# EasyEDA Pro project PX4_FMUv6X_Dev_Board.eprj, schematic FMUv6X Dev Board, sheets 7 to 11 of 11

## Sheets
7 Ethernet 100 Base-TX: Create Date: 2025-08-15; Page Name: Ethernet 100 Base-TX; Update Date: 2025-08-15
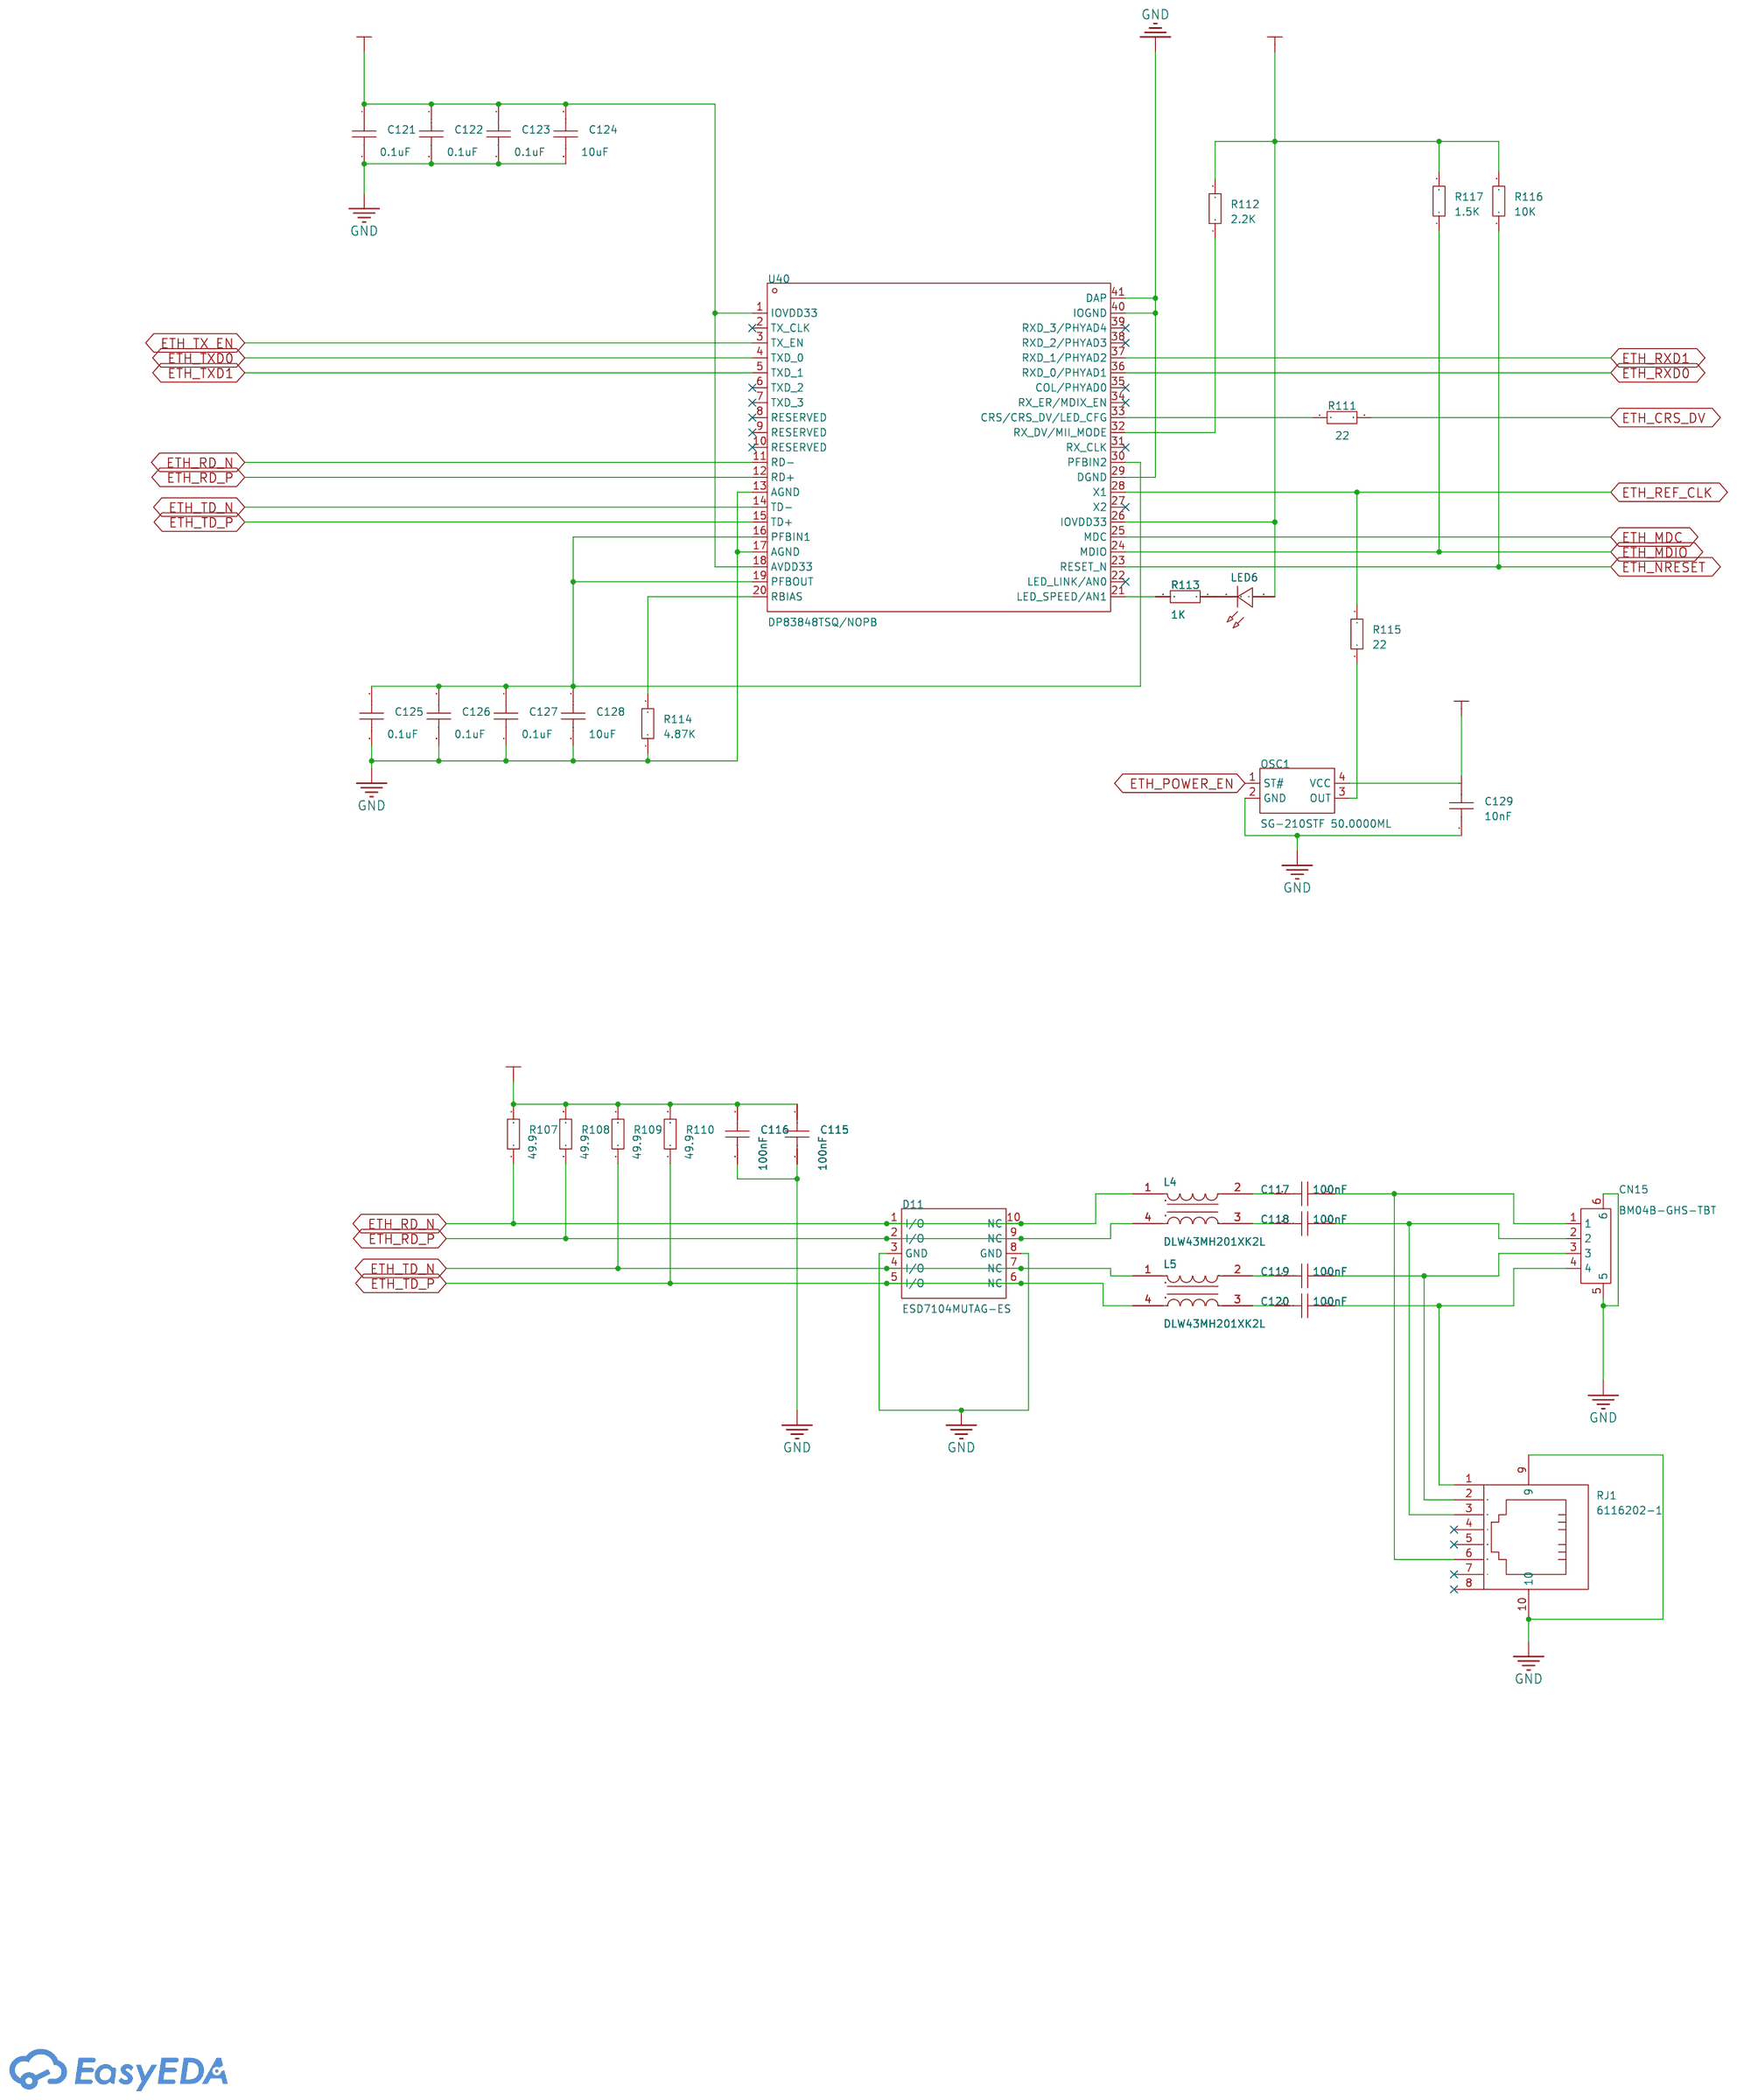
[diagram p6: Ethernet 100 Base-TX]
8 UART and GPS Connectors: Create Date: 2025-08-15; Page Name: UART and GPS Connectors; Update Date: 2025-08-17
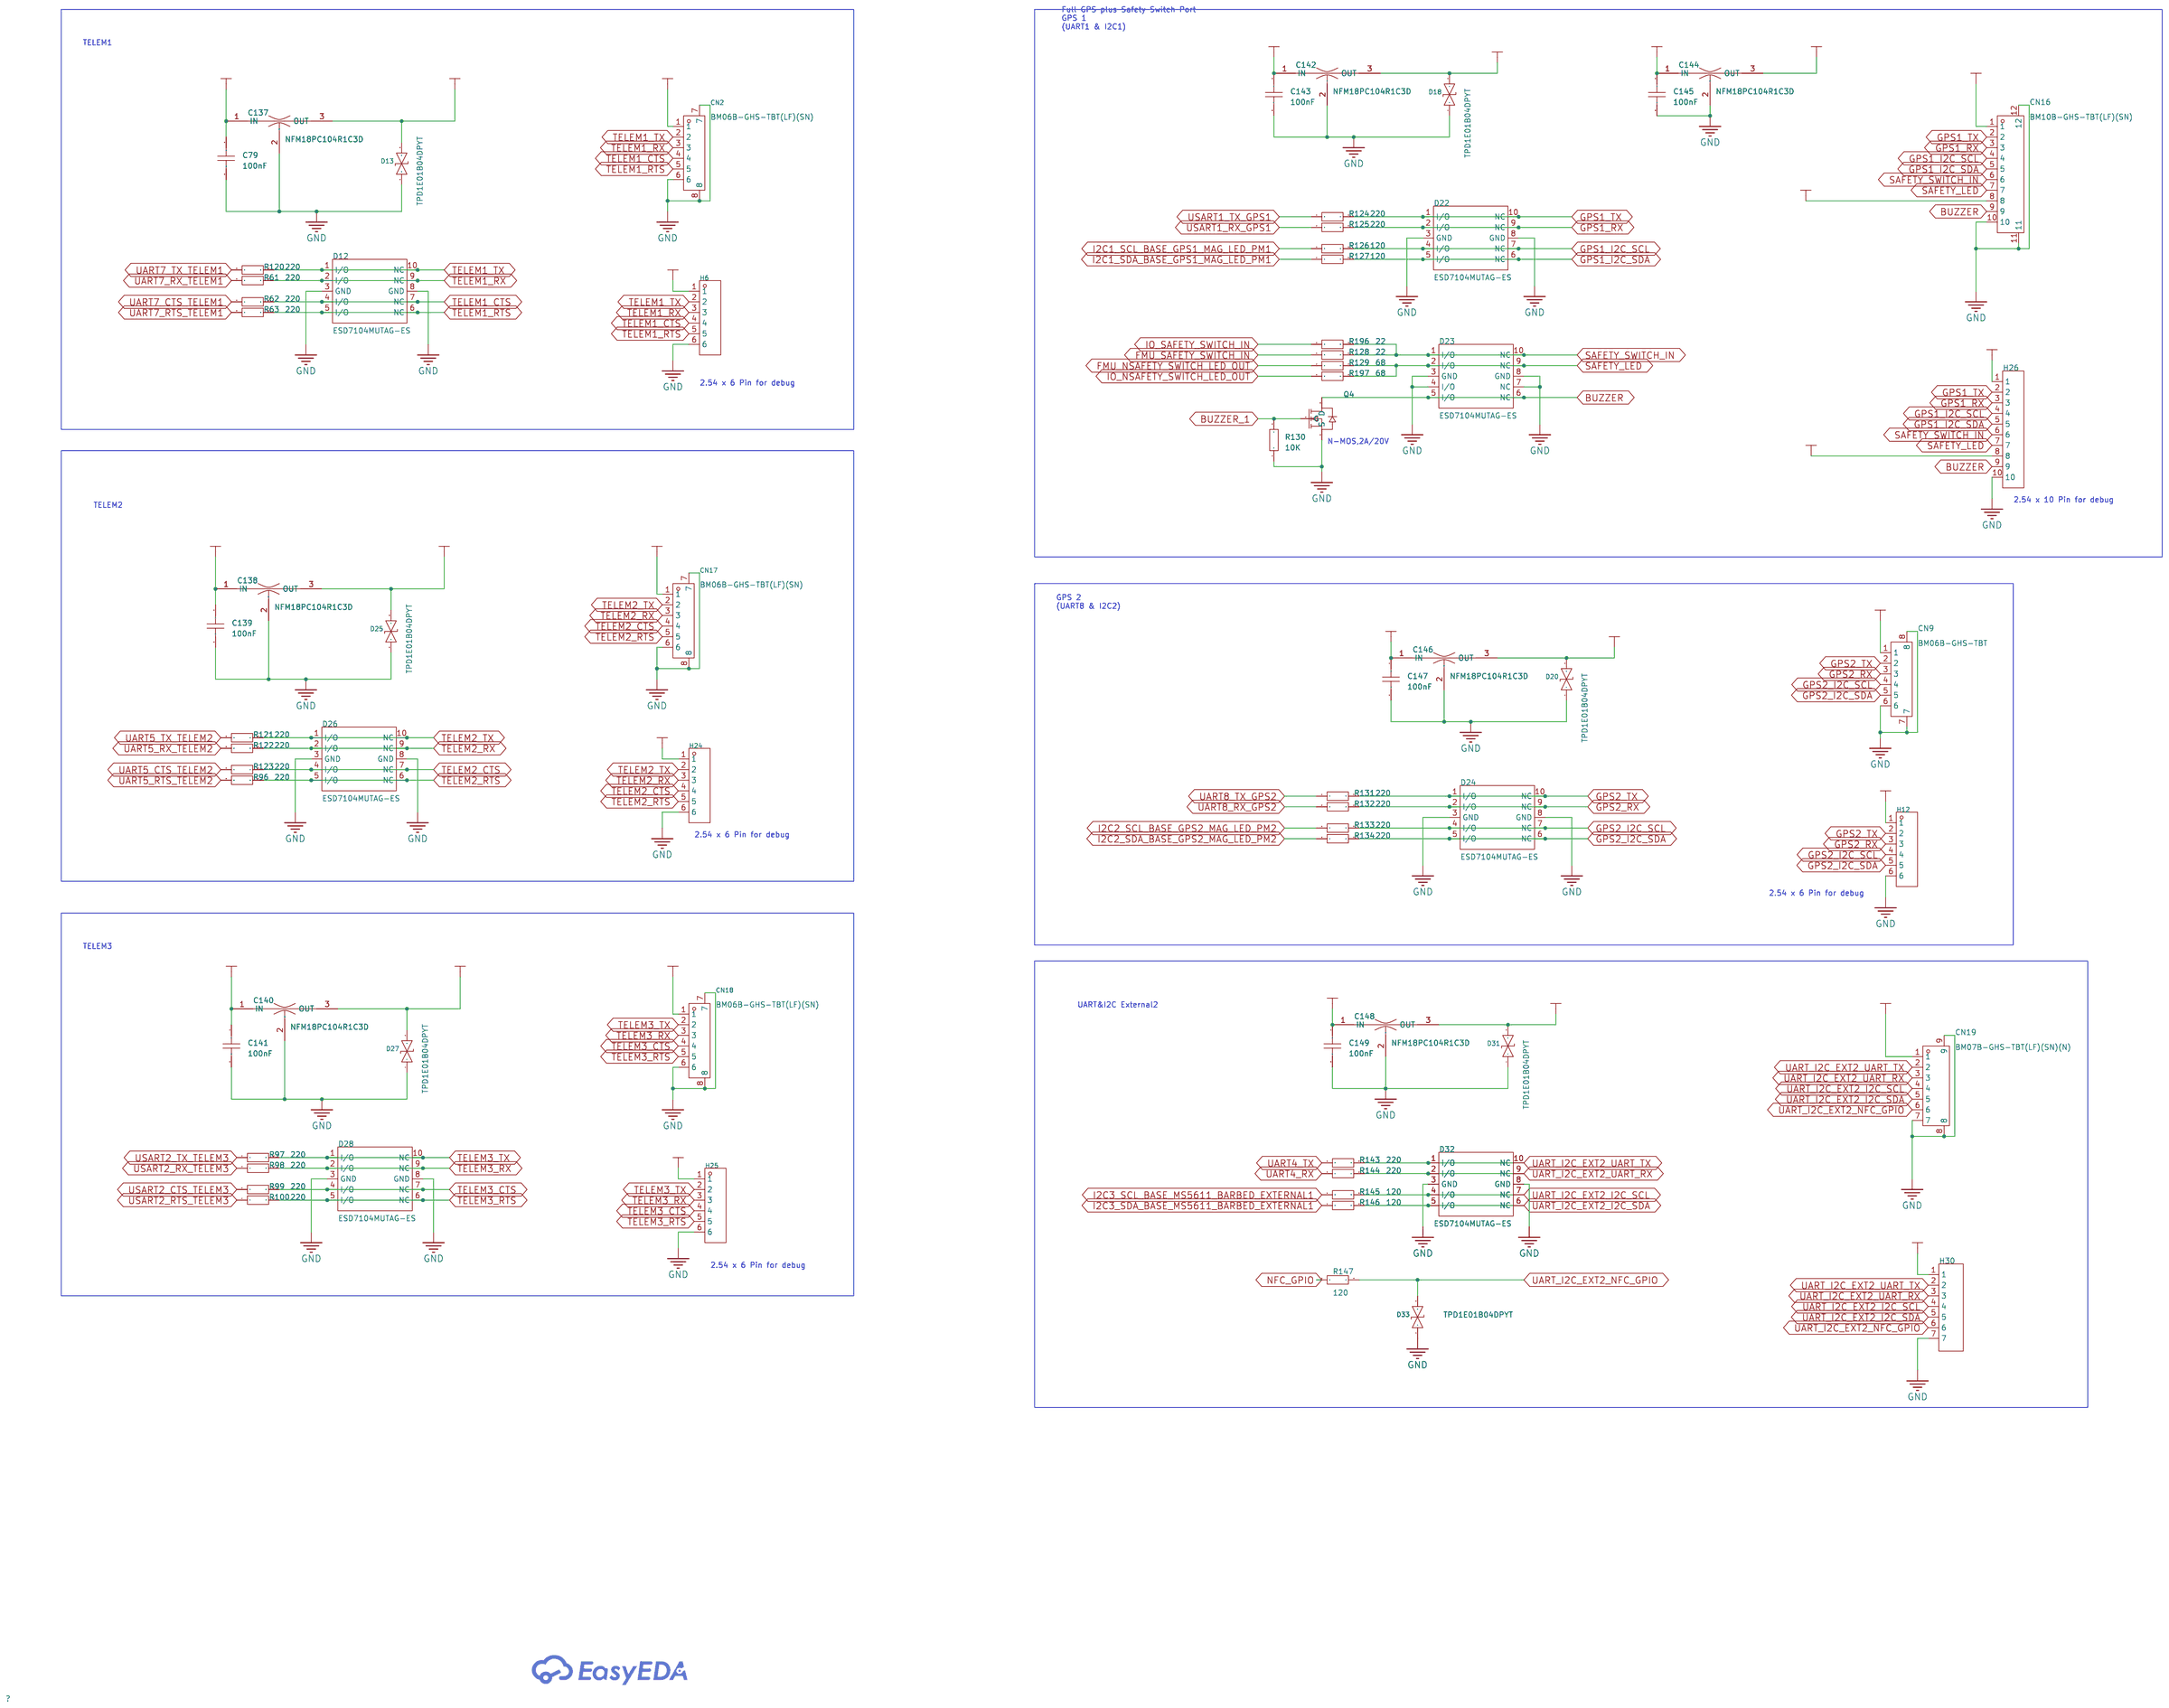
[diagram p7: UART and GPS Connectors]
9 GPIO 2.54mm 16x8: Create Date: 2025-08-15; Page Name: GPIO 2.54mm 16x8; Update Date: 2025-08-17
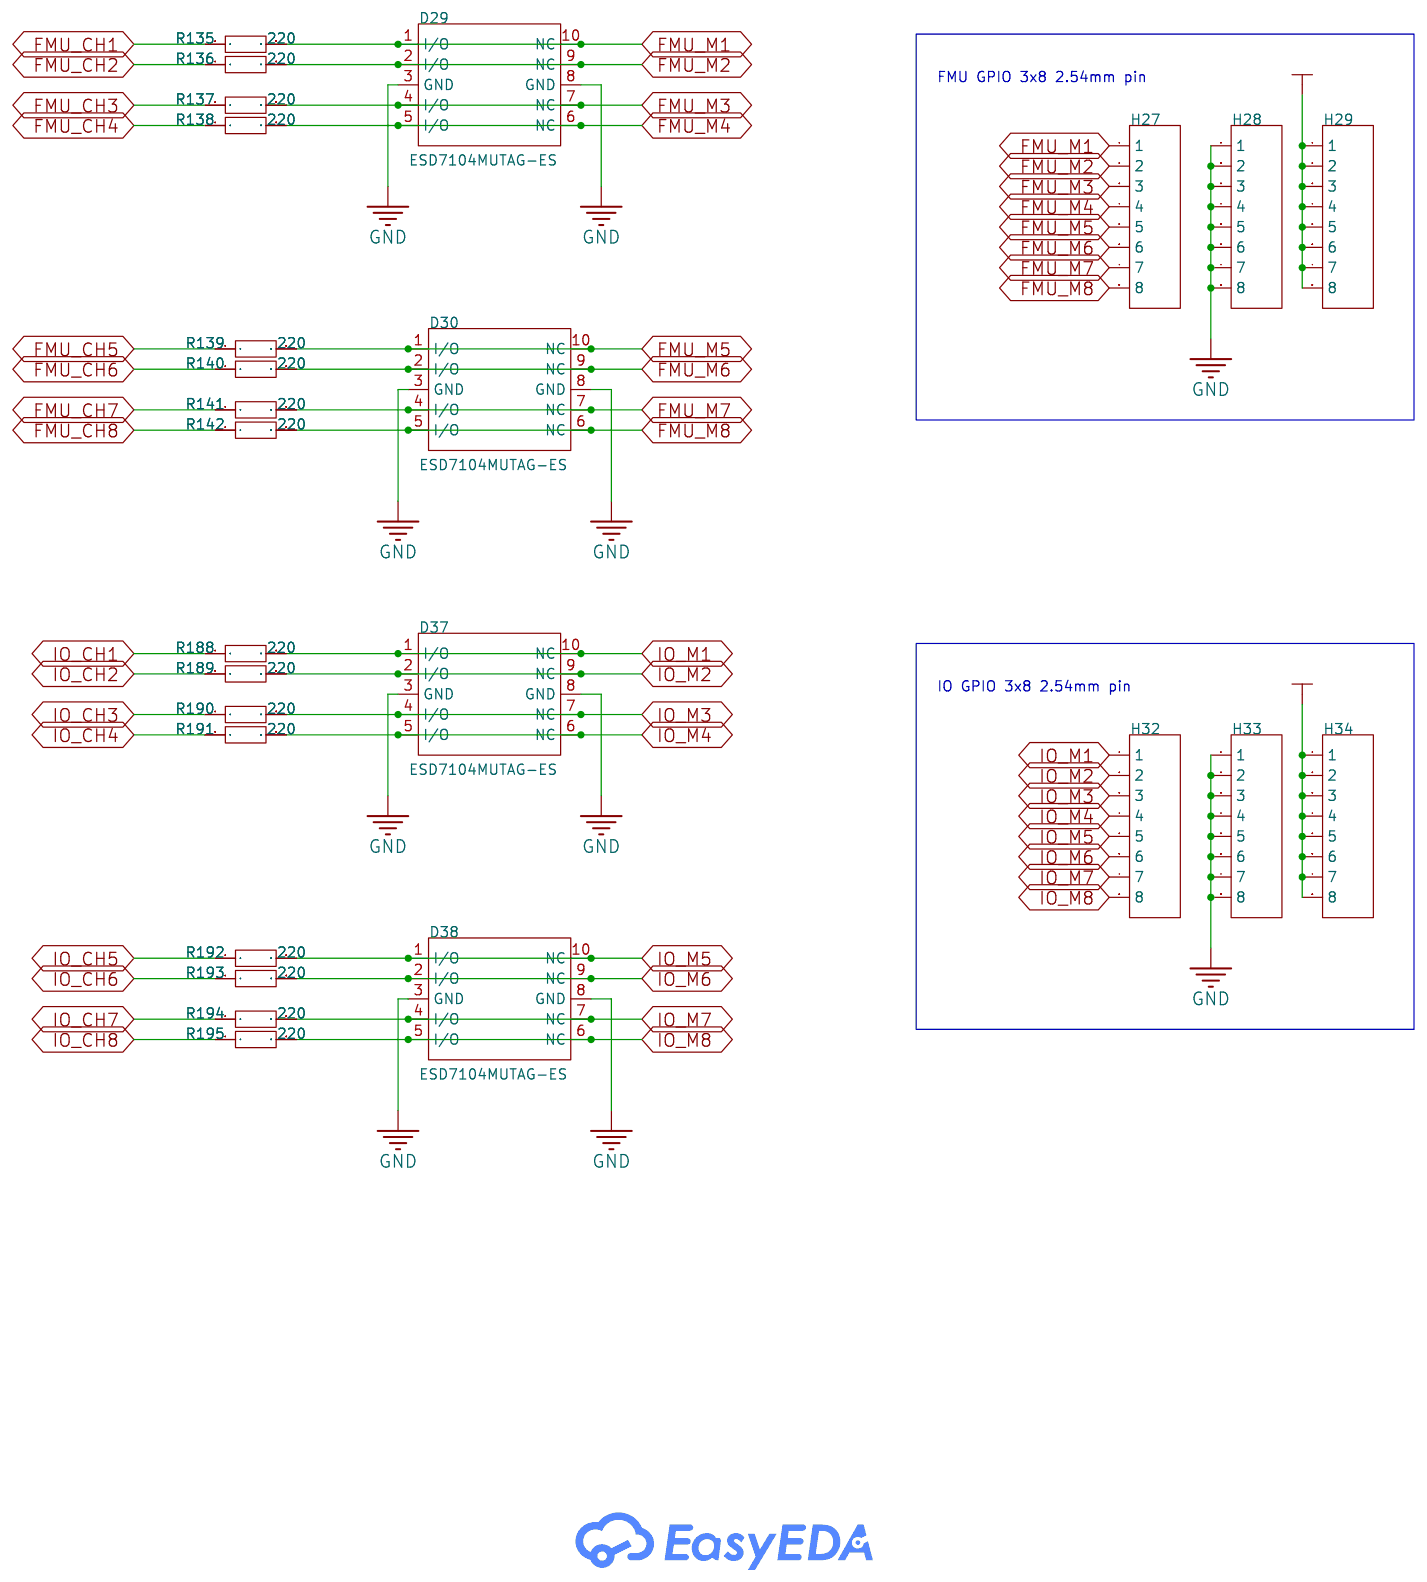
[diagram p8: GPIO 2.54mm 16x8]
10 IO MCU STM32F103C8T7: Create Date: 2025-08-16; Page Name: IO MCU STM32F103C8T7; Update Date: 2025-08-17
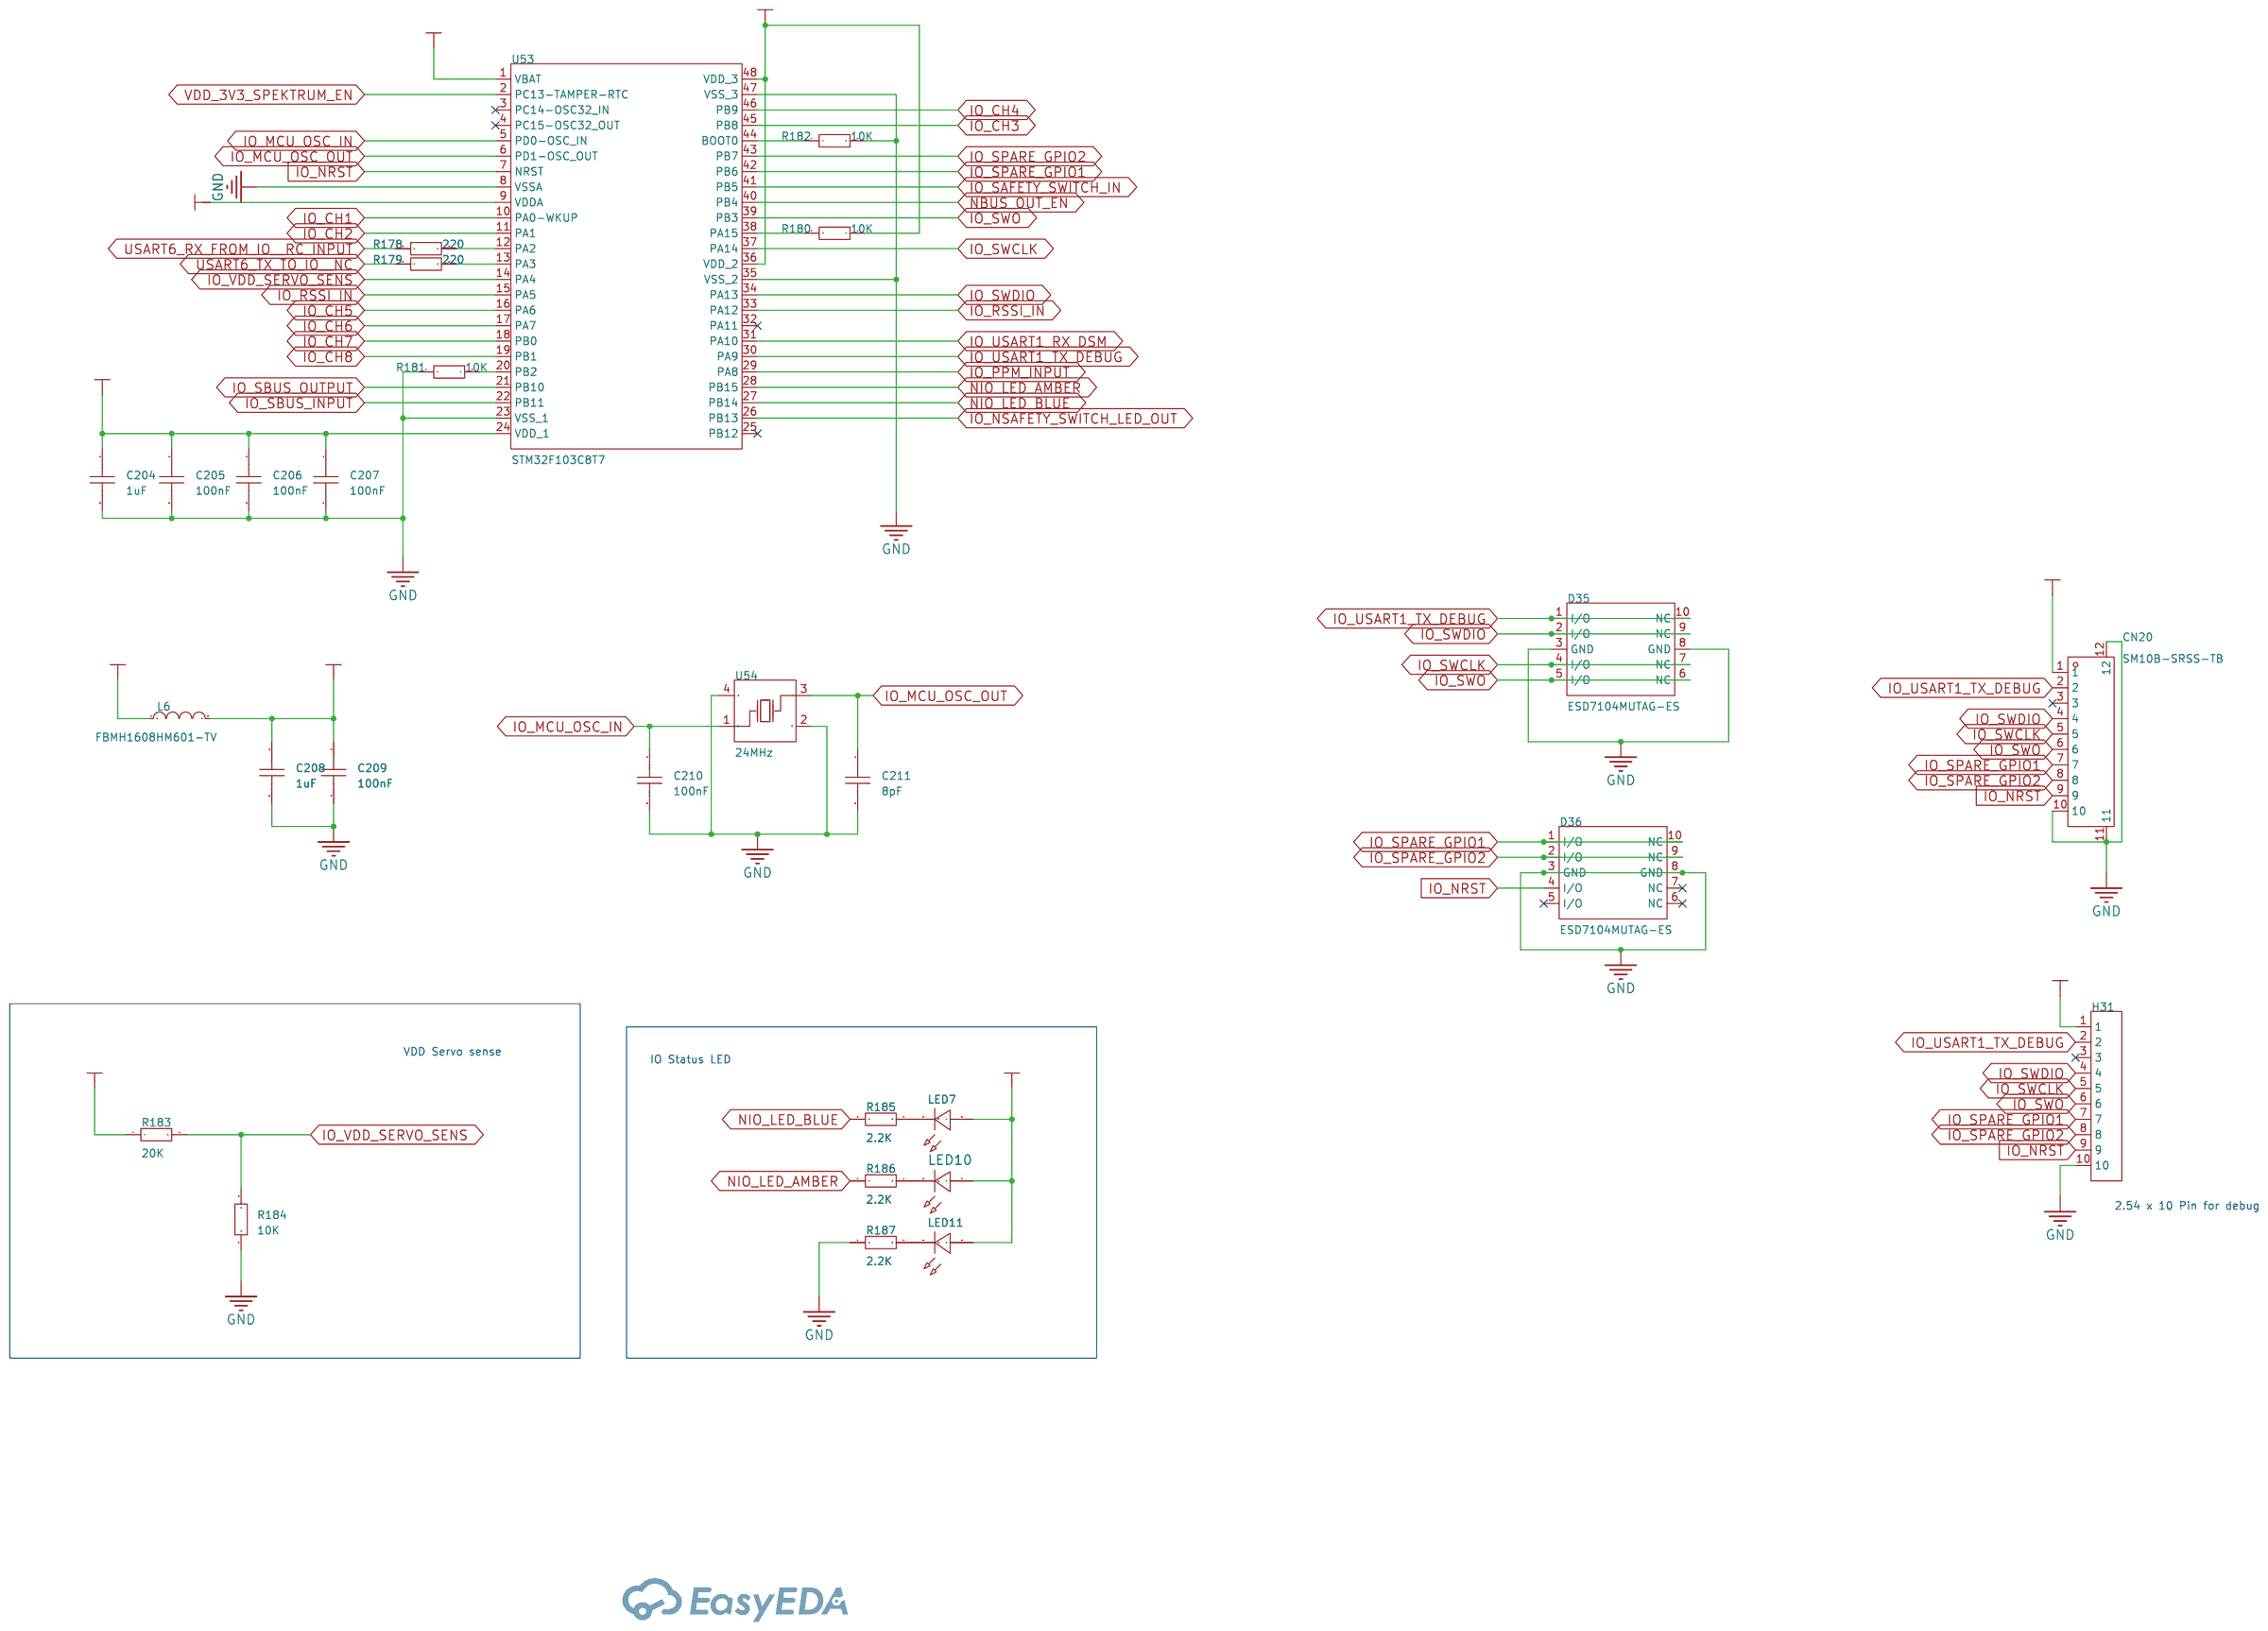
[diagram p9: IO MCU STM32F103C8T7]
11 RC and ADIO: Create Date: 2025-08-16; Page Name: RC and ADIO; Update Date: 2025-08-17
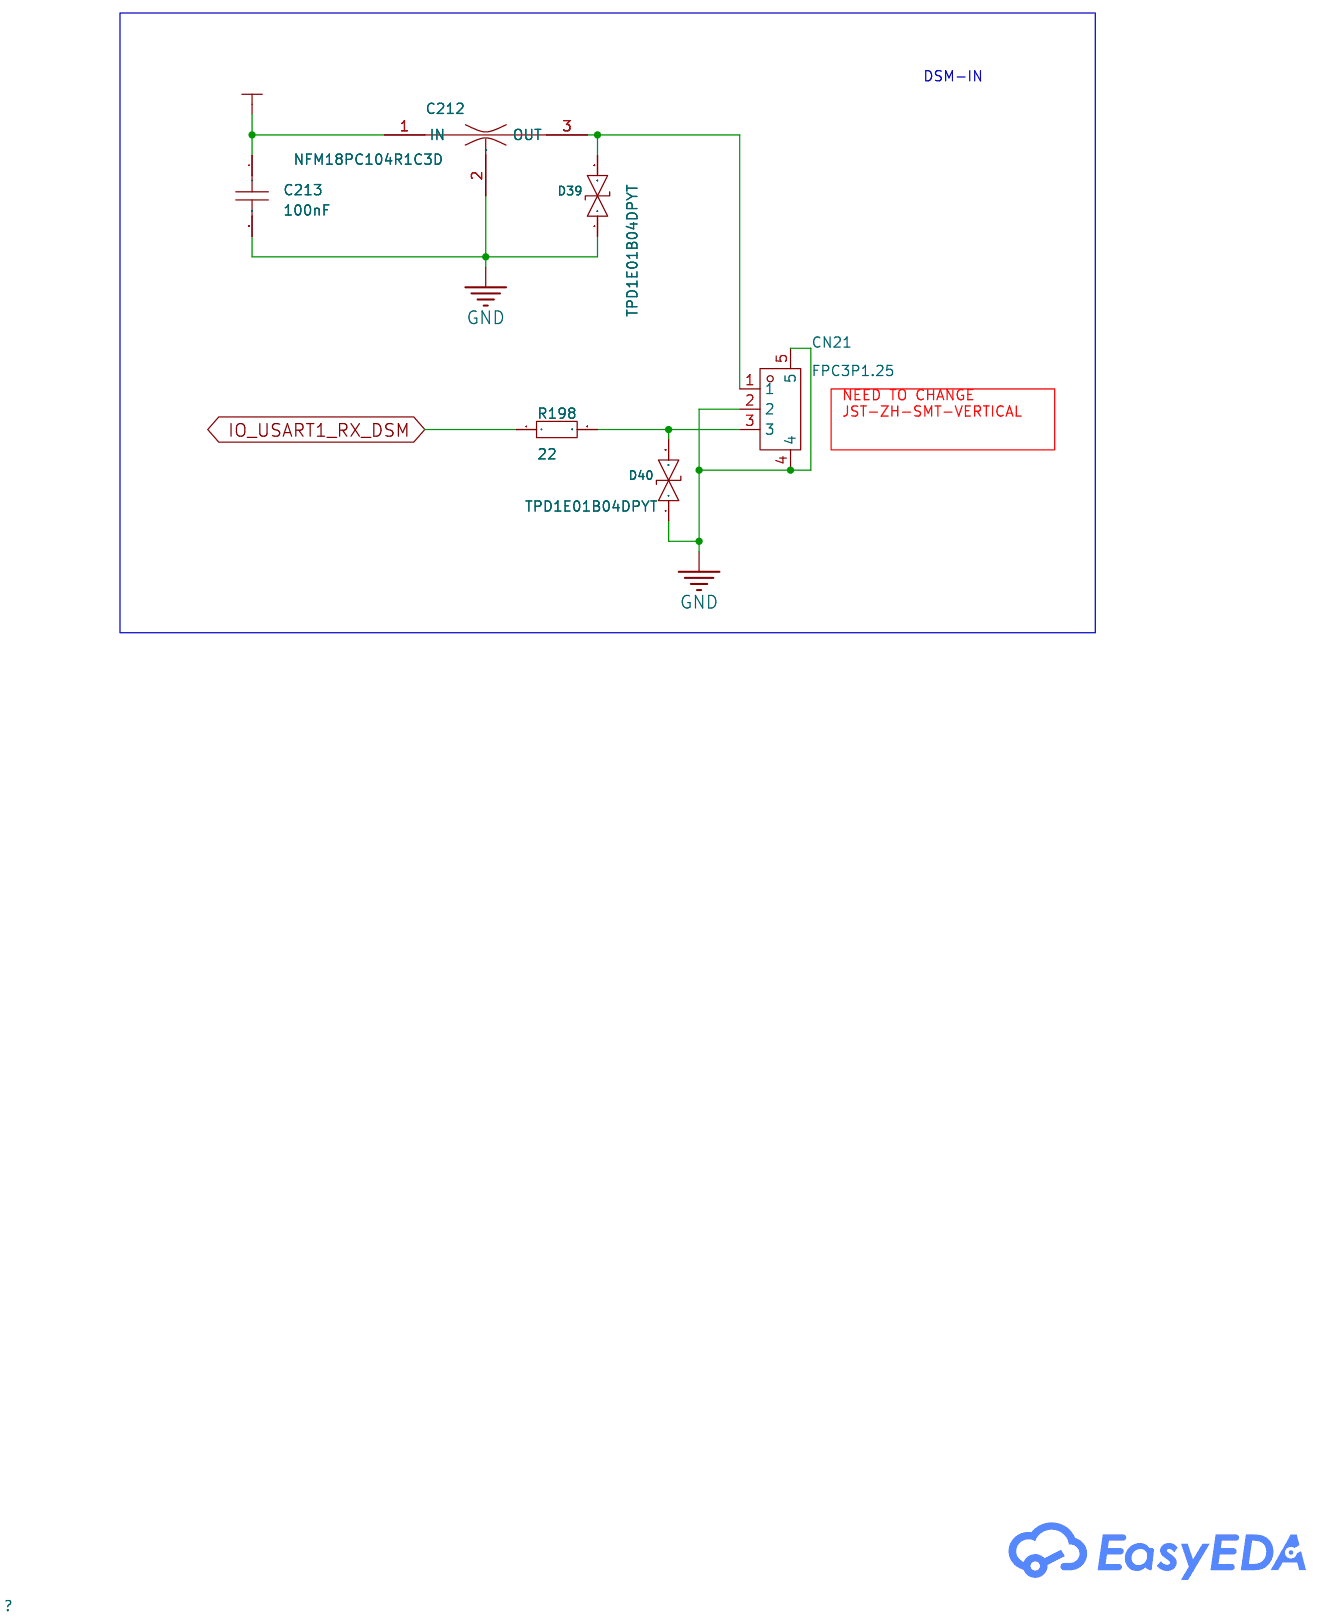
[diagram p10: RC and ADIO]

## Parts
sheet Ethernet 100 Base-TX
C115  100nF  [C0201]
C116  100nF  [C0201]
C117  100nF  [C0201]
C118  100nF  [C0201]
C119  100nF  [C0201]
C120  100nF  [C0201]
C121  0.1uF  [C0201]
C122  0.1uF  [C0201]
C123  0.1uF  [C0201]
C124  10uF  [C0201]
C125  0.1uF  [C0201]
C126  0.1uF  [C0201]
C127  0.1uF  [C0201]
C128  10uF  [C0201]
C129  10nF  [C0201]
CN15  BM04B-GHS-TBT  [CONN-SMD_4P-P1.25_BM04B-GHS-TBT-LF-SN]
D11  ESD7104MUTAG-ES  [DFN-10_L2.5-W1.0-P0.50-BL]
L4  DLW43MH201XK2L  [FILTER-SMD_4P-L4.5-W3.2-BL_DLW43MH201XK2L]
L5  DLW43MH201XK2L  [FILTER-SMD_4P-L4.5-W3.2-BL_DLW43MH201XK2L]
LED6  -  [LED0402-RD_YELLOW]
OSC1  SG-210STF 50.0000ML  [OSC-SMD_4P-L2.5-W2.0-BL]
R107  49.9  [R0603]
R108  49.9  [R0603]
R109  49.9  [R0603]
R110  49.9  [R0603]
R111  22  [R0603]
R112  2.2K  [R0603]
R113  1K  [R0603]
R114  4.87K  [R0603]
R115  22  [R0603]
R116  10K  [R0603]
R117  1.5K  [R0603]
RJ1  6116202-1  [RJ45-TH_6116202-1]
U40  DP83848TSQ/NOPB  [WQFN-40_L6.0-W6.0-P0.50-BL-EP]
sheet GPIO 2.54mm 16x8
D29  ESD7104MUTAG-ES  [DFN-10_L2.5-W1.0-P0.50-BL]
D30  ESD7104MUTAG-ES  [DFN-10_L2.5-W1.0-P0.50-BL]
D37  ESD7104MUTAG-ES  [DFN-10_L2.5-W1.0-P0.50-BL]
D38  ESD7104MUTAG-ES  [DFN-10_L2.5-W1.0-P0.50-BL]
H27  -  [HDR-TH_8P-P2.54-V-M]
H28  -  [HDR-TH_8P-P2.54-V-M]
H29  -  [HDR-TH_8P-P2.54-V-M]
H32  -  [HDR-TH_8P-P2.54-V-M]
H33  -  [HDR-TH_8P-P2.54-V-M]
H34  -  [HDR-TH_8P-P2.54-V-M]
R135  220  [R0603]
R136  220  [R0603]
R137  220  [R0603]
R138  220  [R0603]
R139  220  [R0603]
R140  220  [R0603]
R141  220  [R0603]
R142  220  [R0603]
R188  220  [R0603]
R189  220  [R0603]
R190  220  [R0603]
R191  220  [R0603]
R192  220  [R0603]
R193  220  [R0603]
R194  220  [R0603]
R195  220  [R0603]
sheet IO MCU STM32F103C8T7
C204  1uF  [C0201]
C205  100nF  [C0201]
C206  100nF  [C0201]
C207  100nF  [C0201]
C208  1uF  [C0201]
C209  100nF  [C0201]
C210  100nF  [C0201]
C211  8pF  [C0201]
CN20  SM10B-SRSS-TB  [CONN-SMD_10P-P1.00_SM10B-SRSS-TB]
D35  ESD7104MUTAG-ES  [DFN-10_L2.5-W1.0-P0.50-BL]
D36  ESD7104MUTAG-ES  [DFN-10_L2.5-W1.0-P0.50-BL]
H31  -  [HDR-TH_10P-P2.54-V-F]
L6  FBMH1608HM601-TV  [L0603]
LED7  -  [LED0402-RD_YELLOW]
LED10  -  [LED0402-RD_YELLOW]
LED11  -  [LED0402-RD_YELLOW]
R178  220  [R0603]
R179  220  [R0603]
R180  10K  [R0603]
R181  10K  [R0603]
R182  10K  [R0603]
R183  20K  [R0603]
R184  10K  [R0603]
R185  2.2K  [R0603]
R186  2.2K  [R0603]
R187  2.2K  [R0603]
U53  STM32F103C8T7  [LQFP-48_L7.0-W7.0-P0.50-LS9.0-BL]
U54  24MHz  [CRYSTAL-SMD_4P-L3.2-W2.5-BL]
sheet RC and ADIO
C212  NFM18PC104R1C3D  [FILTER-SMD_3P-L1.6-W0.8-L_NFM18CC223R1C3D]
C213  100nF  [C0201]
CN21  FPC3P1.25  [CONN-SMD_3P-P1.25_1.25T-3PWT]
D39  TPD1E01B04DPYT  [X1SON-2_L1.0-W0.6-P0.65-BI]
D40  TPD1E01B04DPYT  [X1SON-2_L1.0-W0.6-P0.65-BI]
R198  22  [R0603]
sheet UART and GPS Connectors
C79  100nF  [C0201]
C137  NFM18PC104R1C3D  [FILTER-SMD_3P-L1.6-W0.8-L_NFM18CC223R1C3D]
C138  NFM18PC104R1C3D  [FILTER-SMD_3P-L1.6-W0.8-L_NFM18CC223R1C3D]
C139  100nF  [C0201]
C140  NFM18PC104R1C3D  [FILTER-SMD_3P-L1.6-W0.8-L_NFM18CC223R1C3D]
C141  100nF  [C0201]
C142  NFM18PC104R1C3D  [FILTER-SMD_3P-L1.6-W0.8-L_NFM18CC223R1C3D]
C143  100nF  [C0201]
C144  NFM18PC104R1C3D  [FILTER-SMD_3P-L1.6-W0.8-L_NFM18CC223R1C3D]
C145  100nF  [C0201]
C146  NFM18PC104R1C3D  [FILTER-SMD_3P-L1.6-W0.8-L_NFM18CC223R1C3D]
C147  100nF  [C0201]
C148  NFM18PC104R1C3D  [FILTER-SMD_3P-L1.6-W0.8-L_NFM18CC223R1C3D]
C149  100nF  [C0201]
CN2  BM06B-GHS-TBT(LF)(SN)  [CONN-SMD_BM06B-GHS-TBT-LF-SN]
CN9  BM06B-GHS-TBT  [CONN-SMD_6P-P1.25_BM06B-GHS-TBT]
CN16  BM10B-GHS-TBT(LF)(SN)  [CONN-SMD_BM10B-GHS-TBT-LF-SN]
CN17  BM06B-GHS-TBT(LF)(SN)  [CONN-SMD_BM06B-GHS-TBT-LF-SN]
CN18  BM06B-GHS-TBT(LF)(SN)  [CONN-SMD_BM06B-GHS-TBT-LF-SN]
CN19  BM07B-GHS-TBT(LF)(SN)(N)  [CONN-SMD_7P-P1.25_BM07B-GHS-TBT-LF-SN-N]
D12  ESD7104MUTAG-ES  [DFN-10_L2.5-W1.0-P0.50-BL]
D13  TPD1E01B04DPYT  [X1SON-2_L1.0-W0.6-P0.65-BI]
D18  TPD1E01B04DPYT  [X1SON-2_L1.0-W0.6-P0.65-BI]
D20  TPD1E01B04DPYT  [X1SON-2_L1.0-W0.6-P0.65-BI]
D22  ESD7104MUTAG-ES  [DFN-10_L2.5-W1.0-P0.50-BL]
D23  ESD7104MUTAG-ES  [DFN-10_L2.5-W1.0-P0.50-BL]
D24  ESD7104MUTAG-ES  [DFN-10_L2.5-W1.0-P0.50-BL]
D25  TPD1E01B04DPYT  [X1SON-2_L1.0-W0.6-P0.65-BI]
D26  ESD7104MUTAG-ES  [DFN-10_L2.5-W1.0-P0.50-BL]
D27  TPD1E01B04DPYT  [X1SON-2_L1.0-W0.6-P0.65-BI]
D28  ESD7104MUTAG-ES  [DFN-10_L2.5-W1.0-P0.50-BL]
D31  TPD1E01B04DPYT  [X1SON-2_L1.0-W0.6-P0.65-BI]
D32  ESD7104MUTAG-ES  [DFN-10_L2.5-W1.0-P0.50-BL]
D33  TPD1E01B04DPYT  [X1SON-2_L1.0-W0.6-P0.65-BI]
H6  -  [HDR-TH_6P-P2.54-V-F]
H12  -  [HDR-TH_6P-P2.54-V-F]
H24  -  [HDR-TH_6P-P2.54-V-F]
H25  -  [HDR-TH_6P-P2.54-V-F]
H26  -  [HDR-TH_10P-P2.54-V-F]
H30  -  [HDR-TH_7P-P2.54-V-F]
Q4  -  [SOT-23-3_L2.9-W1.3-P1.90-LS2.4-BR]
R61  220  [R0603]
R62  220  [R0603]
R63  220  [R0603]
R96  220  [R0603]
R97  220  [R0603]
R98  220  [R0603]
R99  220  [R0603]
R100  220  [R0603]
R120  220  [R0603]
R121  220  [R0603]
R122  220  [R0603]
R123  220  [R0603]
R124  220  [R0603]
R125  220  [R0603]
R126  120  [R0603]
R127  120  [R0603]
R128  22  [R0603]
R129  68  [R0603]
R130  10K  [R0603]
R131  220  [R0603]
R132  220  [R0603]
R133  220  [R0603]
R134  220  [R0603]
R143  220  [R0603]
R144  220  [R0603]
R145  120  [R0603]
R146  120  [R0603]
R147  120  [R0603]
R196  22  [R0603]
R197  68  [R0603]

## Library data of the parts
C79 C115-C129 C139 C141 C143 C145 C147 C149 C204-C211 C213 = CAP_0201: Supplier Footprint: 0201
CN15 = BM04B-GHS-TBT: Pins Structure:1x4P Pitch:1.25mm Mounting Type:Vertical welding Reference Series:GH Number of Pins:4P Number of Rows:1 Number of PINs Per Row:4 Row Spacing:- Current Rating:1A Contact Material:Phosphor Bronze Contact Plating:Tin Operating Temperature:-25℃; LCSC Part Name: 1x4P 间距:1.25mm 立贴 系列:GH; Supplier Part: C20089142; Manufacturer: JST; Supplier Footprint: SMD,P=1.25mm; JLCPCB Part Class: Extended Part; Datasheet: https://atta.szlcsc.com/upload/public/pdf/source/20221128/D5F81EE9B4EA03745FB033843433A0AF.pdf; Supplier: LCSC; Pins Structure: 1x4P; Pitch: 1.25mm; Mounting Type: Vertical welding; Reference Series: GH; Number of Pins: 4P; Number of Rows: 1; Number of PINs Per Row: 4; Current Rating: 1A; Contact Material: Phosphor Bronze; Contact Plating: Tin; Operating Temperature: -25℃~+85℃; Voltage Rating: 50V; Plastic Material: PA9T; Flame Retardant Rating: UL94V-0; Supplementary Features: Auxiliary soldering legs; Color: White; Z-Height of the Board: 4.05mm; X-Length of Bottom Edge on Board (Spacing Line): 8.25mm; Y-Width of Bottom Edge on Board: 4.32mm
D11 D12 D22-D24 D26 D28-D30 D32 D35-D38 = ESD7104MUTAG-ES: Polarity:Unidirectional Reverse Stand-Off Voltage (Vrwm):5V Clamping Voltage:25V Peak Pulse Current (Ipp):4.5A Peak Pulse Power Dissipation (Ppp):120W Voltage - Breakdown:6.5V Reverse Leakage Current (Ir):1uA Number of Channels:4 Operating Temperature:-40; LCSC Part Name: 5.0V4路双向ESD防护器件，5A、20kV、0.4pF；USB3.X/USB4.0/HDMI等高速通讯防护。; Supplier Part: C41429323; Manufacturer: ElecSuper(静芯); Supplier Footprint: DFN2510-10L; Datasheet: https://atta.szlcsc.com/upload/public/pdf/source/20250407/A6F2056571815425D7EFAF408E3DDC0D.pdf; Supplier: LCSC; Polarity: Unidirectional; Reverse Stand-Off Voltage (Vrwm): 5V; Clamping Voltage: 25V; Peak Pulse Current (Ipp): 4.5A; Peak Pulse Power Dissipation (Ppp): 120W; Voltage - Breakdown: 6.5V; Reverse Leakage Current (Ir): 1uA; Number of Channels: 4; Operating Temperature: -40℃~+125℃; Type: ESD; Junction Capacitance: 0.4pF
L4 L5 = DLW43MH201XK2L: LCSC Part Name: 两路 1812共模滤波器; Supplier Part: C123086; Manufacturer: muRata(村田); Supplier Footprint: 1812; JLCPCB Part Class: Extended Part; Datasheet: https://atta.szlcsc.com/upload/public/pdf/source/20170728/C123086_1501225765795848826.pdf; Supplier: LCSC; Number of Lines: 2; Withstanding Voltage: 125V; Current Rating: 110mA; Inductance @ Frequency: 200uH@100kHz; Voltage Rating - DC: 20V; DC Resistance (DCR): 4.5Ω; Operating Temperature: -40℃~+105℃
LED6 LED11 = LED_0402-G: Supplier Footprint: 0402
OSC1 = SG-210STF 50.0000ML: Supplier Part: C17510047; Manufacturer: EPSON(爱普生); Supplier Footprint: SMD2520-4P; JLCPCB Part Class: Extended Part; Datasheet: https://atta.szlcsc.com/upload/public/pdf/source/20230810/47BD9D7CE3A76760C97AF64A0937818D.pdf; Supplier: LCSC
R61-R63 R96-R100 R107-R117 R120-R147 R178-R198 = Res_0603: Supplier Footprint: 0603
RJ1 = 6116202-1: LCSC Part Name: 直插 不带LED; Supplier Part: C404236; Manufacturer: TE Connectivity(泰科电子); Supplier Footprint: 插件; JLCPCB Part Class: Extended Part; Datasheet: https://atta.szlcsc.com/upload/public/pdf/source/20190718/C404236_6425A2BB65C8C694E826CC75A746BA0A.pdf; Supplier: LCSC; Connector Type: RJ45Receptacle; Number of Ports: 1; Mounting Style: Straight; Shielding: 有屏蔽; LED: 不带LED; Ratings: cat5; Contact Material: Phosphor bronze; Contact Plating: Gold; Operating Temperature Range: -40℃~+85℃
U40 = DP83848TSQ/NOPB: LCSC Part Name: DP83848x PHYTER Mini / LS Single Port 10/100 Mb/s 以太网收发器; Supplier Part: C92110; Manufacturer: TI(德州仪器); Supplier Footprint: WQFN-40-EP(6x6); JLCPCB Part Class: Extended Part; Datasheet: https://www.ti.com/cn/lit/gpn/dp83848t; Supplier: LCSC; Interface: MII；RMII; Voltage - Supply: 3.3V; Operating Temperature: -40℃~+125℃
H27-H29 H32-H34 = HDR-M_2.54_1x8P: Supplier Footprint: Through
CN20 = SM10B-SRSS-TB: LCSC Part Name: 1x10P 间距:1mm 卧贴 系列:SH; Supplier Part: C20089332; Manufacturer: JST; Supplier Footprint: SMD,P=1mm,卧贴; JLCPCB Part Class: Extended Part; Datasheet: https://atta.szlcsc.com/upload/public/pdf/source/20220125/8D1415C84023CDA874F833913395E8A2.pdf; Supplier: LCSC; Pins Structure: 1x10P; Pitch: 1mm; Mounting Style: Horizontal attachment; Reference Series: SH; Number of Pins: 10P; Number of Rows: 1; Number of PINs Per Row: 10; Current Rating (Max): 1A; Contact Material: Copper alloy; Contact Plating: Tin; Operating Temperature Range: -25℃~+85℃; Rated Voltage (Max): 50V; Plastic Material: PA; Flame Retardant Rating: UL94V-0; Supplementary Features: Auxiliary soldering legs; Colour: White; Z-Height of the Board: 2.9mm; X-Length of Bottom Edge on Board (Spacing Line): 12mm; Y-Width of Bottom Edge on Board: 4.32mm
H26 H31 = HDR-F_2.54_1x10P: Supplier Footprint: Through
L6 = FBMH1608HM601-TV: LCSC Part Name: 单路 0603磁珠 阻抗600Ω@100MHz; Supplier Part: C515368; Manufacturer: TAIYO YUDEN(太诱); Supplier Footprint: 0603; JLCPCB Part Class: Extended Part; Datasheet: https://atta.szlcsc.com/upload/public/pdf/source/20200417/C515365_089FE358CB0A746AF2619FA4531FB460.pdf; Supplier: LCSC; Impedance @ Frequency: 600Ω@100MHz; Tolerance: ±25%; DC Resistance: 170mΩ; Current Rating: 900mA; Circuits: 1
LED7 = LED_0402-B: Supplier Footprint: 0402
LED10 = LED_0402-R: Supplier Footprint: 0402
U53 = STM32F103C8T7: LCSC Part Name: 主流增强型ARM Cortex-M3 MCU，具有64 KB Flash、72 MHz CPU、电机控制、USB和CAN; Supplier Part: C1121900; Manufacturer: ST(意法半导体); Supplier Footprint: LQFP-48(7x7); JLCPCB Part Class: Extended Part; Datasheet: https://atta.szlcsc.com/upload/public/pdf/source/20191108/C446030_27D91C05707EDD0145409FE106B48E64.pdf; Supplier: LCSC; CPU Core: ARM-M3; CPU Maximum Speed: 72MHz; Program Storage Size: 64KB; Program Memory Type: FLASH; Number of I/O: 37; ADC (Bit): 12bit; Voltage - Supply: 2V~3.6V
U54 = 24MHz: Supplier Part: C9900010233; Supplier Footprint: 3225; JLCPCB Part Class: Extended Part; Supplier: LCSC
C137 C138 C140 C142 C144 C146 C148 C212 = NFM18PC104R1C3D: Nominal Capacitance:100nF CapacitanceTolerance:±20% CapacitanceTolerance:±20% DC Rated Voltage:16V Rated Current:2A DC Resistance:30mΩ Operating Temperature:-55℃~+125℃ Operating Temperature:-55℃~+125℃; LCSC Part Name: 100nF(104) ±20% 16V; Supplier Part: C111493; Manufacturer: muRata(村田); Supplier Footprint: SMD-3P,0.8x1.6mm; JLCPCB Part Class: Extended Part; Datasheet: https://atta.szlcsc.com/upload/public/pdf/source/20170511/1494500112197.pdf; Supplier: LCSC; Nominal Capacitance: 100nF; CapacitanceTolerance: ±20%; DC Rated Voltage: 16V; Rated Current: 2A; DC Resistance: 30mΩ; Operating Temperature: -55℃~+125℃
CN21 = FPC3P1.25: Supplier Part: C9900020598; Supplier Footprint: JST-SH3-pin1.25mm; JLCPCB Part Class: Extended Part; Supplier: LCSC
D13 D18 D20 D25 D27 D31 D33 D39 D40 = TPD1E01B04DPYT: Reverse Stand-Off Voltage (Vrwm):3.6V Maximum Clamping Voltage:15V Peak Pulse Current (Ipp)@10/1000us:2.5A@(8/20us) Peak Pulse Power Dissipation (Ppp)@10/1000us:27W Breakdown Voltage:6.4V Operating Temperature:-40℃~+125℃@(Ta) Operating Temperature:-40℃~+1; Supplier Part: C1973299; Manufacturer: TI(德州仪器); Supplier Footprint: X1-SON-2(0.6x1); JLCPCB Part Class: Extended Part; Datasheet: https://www.ti.com/cn/lit/gpn/tpd1e01b04; Supplier: LCSC; Reverse Stand-Off Voltage (Vrwm): 3.6V; Maximum Clamping Voltage: 15V; Peak Pulse Current (Ipp)@10/1000us: 2.5A@(8/20us); Peak Pulse Power Dissipation (Ppp)@10/1000us: 27W; Breakdown Voltage: 6.4V; Operating Temperature: -40℃~+125℃@(Ta); Type: ESD
CN2 CN17 CN18 = BM06B-GHS-TBT(LF)(SN): Pins Structure:1x6P Pitch:1.25mm Mounting Style:Brick nogging Reference Series:GH Number of Pins:6P Number of Rows:1 Number of PINs Per Row:6 Row Spacing:- Current Rating (Max):1A Operating Temperature Range:-25℃~+85℃ Operating Temperature Range:-25℃~+85℃; LCSC Part Name: 1x6P 间距:1.25mm 立贴 系列:GH; Supplier Part: C495534; Manufacturer: JST; Supplier Footprint: SMD,P=1.25mm; JLCPCB Part Class: Extended Part; Datasheet: https://atta.szlcsc.com/upload/public/pdf/source/20200407/C495534_3BC2F65FD4BBCAB31B411FEBD8FE0382.pdf; Supplier: LCSC; Pins Structure: 1x6P; Pitch: 1.25mm; Mounting Style: Brick nogging; Reference Series: GH; Number of Pins: 6P; Number of Rows: 1; Number of PINs Per Row: 6; Current Rating (Max): 1A; Operating Temperature Range: -25℃~+85℃
CN9 = BM06B-GHS-TBT: Pins Structure:1x6P Pitch:1.25mm Mounting Style:Standing paste Reference Series:GH Number of Pins:6P Number of Rows:1 Number of PINs Per Row:6 Row Spacing:- Current Rating (Max):1A Contact Material:Phosphor Bronze Contact Plating:Tin Operating Temperature; LCSC Part Name: 1x6P 间距:1.25mm 立贴 系列:GH; Supplier Part: C20089153; Manufacturer: JST; Supplier Footprint: SMD,P=1.25mm; JLCPCB Part Class: Extended Part; Datasheet: https://atta.szlcsc.com/upload/public/pdf/source/20221128/D5F81EE9B4EA03745FB033843433A0AF.pdf; Supplier: LCSC; Pins Structure: 1x6P; Pitch: 1.25mm; Mounting Style: Standing paste; Reference Series: GH; Number of Pins: 6P; Number of Rows: 1; Number of PINs Per Row: 6; Current Rating (Max): 1A; Contact Material: Phosphor Bronze; Contact Plating: Tin; Operating Temperature Range: -25℃~+85℃; Rated Voltage (Max): 50V; Plastic Material: PA9T; Flame Retardant Rating: UL94V-0; Supplementary Features: Auxiliary soldering legs; Colour: White; Z-Height of the Board: 4.05mm; X-Length of Bottom Edge on Board (Spacing Line): 10.75mm; Y-Width of Bottom Edge on Board: 4.32mm
CN16 = BM10B-GHS-TBT(LF)(SN): Pins Structure:1x10P Pitch:1.25mm Mounting Type:Vertical welding Reference Series:GH Number of Pins:10P Number of Rows:1 Number of PINs Per Row:10 Row Spacing:- Current Rating:1A Contact Material:Phosphor Bronze Contact Plating:Tin Operating Temperature:-; LCSC Part Name: 1x10P 间距:1.25mm 立贴 系列:GH; Supplier Part: C495732; Manufacturer: JST; Supplier Footprint: SMD,P=1.25mm; JLCPCB Part Class: Extended Part; Datasheet: https://atta.szlcsc.com/upload/public/pdf/source/20200407/C495732_2212805856ABD75B03B95CFF4E37D056.pdf; Supplier: LCSC; Pins Structure: 1x10P; Pitch: 1.25mm; Mounting Type: Vertical welding; Reference Series: GH; Number of Pins: 10P; Number of Rows: 1; Number of PINs Per Row: 10; Current Rating: 1A; Contact Material: Phosphor Bronze; Contact Plating: Tin; Operating Temperature: -25℃~+85℃; Voltage Rating: 50V; Plastic Material: PA9T; Flame Retardant Rating: UL94V-0; Supplementary Features: Auxiliary soldering legs; Color: White; Z-Height of the Board: 4.05mm; X-Length of Bottom Edge on Board (Spacing Line): 15.75mm; Y-Width of Bottom Edge on Board: 4.32mm
CN19 = BM07B-GHS-TBT(LF)(SN)(N): LCSC Part Name: 1x7P 间距:1.25mm 立贴 系列:GH; Supplier Part: C378970; Manufacturer: JST; Supplier Footprint: SMD,P=1.25mm; JLCPCB Part Class: Extended Part; Datasheet: https://atta.szlcsc.com/upload/public/pdf/source/20190411/C378970_7BCD15E79143F499DF63A80CF437C3FA.pdf; Supplier: LCSC; Pins Structure: 1x7P; Pitch: 1.25mm; Mounting Style: Standing paste; Reference Series: GH; Number of Pins: 7P; Number of Rows: 1; Number of PINs Per Row: 7; Current Rating (Max): 1A; Contact Material: Phosphor Bronze; Contact Plating: Tin; Operating Temperature Range: -25℃~+85℃; Rated Voltage (Max): 50V; Plastic Material: PA9T; Flame Retardant Rating: UL94V-0; Supplementary Features: Auxiliary soldering legs; Colour: White; Z-Height of the Board: 4.05mm; X-Length of Bottom Edge on Board (Spacing Line): 12mm; Y-Width of Bottom Edge on Board: 4.32mm
H6 H12 H24 H25 = HDR-F_2.54_1x6P: Supplier Footprint: Through
H30 = HDR-F_2.54_1x7P: Supplier Footprint: Through
Q4 = N_MOS: Supplier Footprint: SOT-23

## Nets
GND: C79.2 C115.2 C116.2 C121.2 C122.2 C123.2 C124.2 C125.2 C126.2 C127.2 C128.2 C129.2 C137.2(GND) C138.2(GND) C139.2 C140.2(GND) C141.2 C142.2(GND) C143.2 C144.2(GND) C145.2 C146.2(GND) C147.2 C148.2(GND) C149.2 C204.2 C205.2 C206.2 C207.2 C208.2 C209.2 C210.2 C211.2 C212.2(GND) C213.2 CN2.6 CN2.7 CN2.8 CN9.6 CN9.7 CN9.8 CN15.5 CN15.6 CN16.10 CN16.11 CN16.12 CN17.6 CN17.7 CN17.8 CN18.6 CN18.7 CN18.8 CN19.7 CN19.8 CN19.9 CN20.10 CN20.11 CN20.12 CN21.2 CN21.4 CN21.5 D11.3(GND) D11.8(GND) D12.3(GND) D12.8(GND) D13.1 D18.1 D20.1 D22.3(GND) D22.8(GND) D23.3(GND) D23.4(I/O) D23.7(NC) D23.8(GND) D24.3(GND) D24.8(GND) D25.1 D26.3(GND) D26.8(GND) D27.1 D28.3(GND) D28.8(GND) D29.3(GND) D29.8(GND) D30.3(GND) D30.8(GND) D31.1 D32.3(GND) D32.8(GND) D33.1 D35.3(GND) D35.8(GND) D36.3(GND) D36.8(GND) D37.3(GND) D37.8(GND) D38.3(GND) D38.8(GND) D39.1 D40.1 H6.6 H12.6 H24.6 H25.6 H26.10 H28.1 H28.2 H28.3 H28.4 H28.5 H28.6 H28.7 H28.8 H30.7 H31.10 H33.1 H33.2 H33.3 H33.4 H33.5 H33.6 H33.7 H33.8 OSC1.2(GND) Q4.2(S) R114.1 R130.1 R181.1 R182.2 R184.1 R187.1 RJ1.9 RJ1.10 U40.13(AGND) U40.17(AGND) U40.29(DGND) U40.40(IOGND) U40.41(DAP) U53.8(VSSA) U53.23(VSS_1) U53.35(VSS_2) U53.47(VSS_3) U54.2(GND) U54.4(GND) ; also on sheet 1 2 3 5 6
VBAT: U53.1(VBAT) ; also on sheet 3
VDD_3V3_SPEKTRUM: C212.1(IN) C213.1 ; also on sheet 2
VDD_3V3_SPEKTRUM_EN: U53.2(PC13-TAMPER-RTC) ; also on sheet 2
VDD_5V_HIPOWER: C79.1 C137.1(IN) C146.1(IN) C147.1 ; also on sheet 2
VDD_5V_IN: LED7.2(A) LED10.1(A) LED11.2(A) ; also on sheet 1 2 3
VDD_5V_PERIPH: C138.1(IN) C139.1 C140.1(IN) C141.1 C142.1(IN) C143.1 C148.1(IN) C149.1 ; also on sheet 2 3
VDD_SERVO: H29.1 H29.2 H29.3 H29.4 H29.5 H29.6 H29.7 H29.8 H34.1 H34.2 H34.3 H34.4 H34.5 H34.6 H34.7 H34.8 R183.1
BUZZER: CN16.9 D23.5(I/O) D23.6(NC) H26.9 Q4.3(D)
BUZZER_1: Q4.1(G) R130.2 ; also on sheet 3
ETH_CRS_DV: R111.2 ; also on sheet 3
ETH_MDC: U40.25(MDC) ; also on sheet 3
ETH_MDIO: R117.1 U40.24(MDIO) ; also on sheet 3
ETH_NRESET: R116.1 U40.23(RESET_N) ; also on sheet 2
ETH_POWER_EN: OSC1.1(ST#) ; also on sheet 2 3
ETH_RD_N: D11.1(I/O) D11.10(NC) L4.1 R107.1 U40.11(RD-)
ETH_RD_P: D11.2(I/O) D11.9(NC) L4.4 R108.1 U40.12(RD+)
ETH_REF_CLK: R115.2 U40.28(X1) ; also on sheet 3
ETH_RXD0: U40.36(RXD_0/PHYAD1) ; also on sheet 3
ETH_RXD1: U40.37(RXD_1/PHYAD2) ; also on sheet 3
ETH_TD_N: D11.4(I/O) D11.7(NC) L5.1 R109.1 U40.14(TD-)
ETH_TD_P: D11.5(I/O) D11.6(NC) L5.4 R110.1 U40.15(TD+)
ETH_TX_EN: U40.3(TX_EN) ; also on sheet 3
ETH_TXD0: U40.4(TXD_0) ; also on sheet 3
ETH_TXD1: U40.5(TXD_1) ; also on sheet 3
ETH_VDD_IO_3V3: C115.1 C116.1 C121.1 C122.1 C123.1 C124.1 C129.1 LED6.2(A) R107.2 R108.2 R109.2 R110.2 R112.2 R116.2 R117.2 U40.1(IOVDD33) U40.18(AVDD33) U40.26(IOVDD33) ; also on sheet 2
FMU_CH1: R135.1 ; also on sheet 3
FMU_CH2: R136.1 ; also on sheet 3
FMU_CH3: R137.1 ; also on sheet 3
FMU_CH4: R138.1 ; also on sheet 3
FMU_CH5: R139.1 ; also on sheet 3
FMU_CH6: R140.1 ; also on sheet 3
FMU_CH7: R141.1 ; also on sheet 3
FMU_CH8: R142.1 ; also on sheet 3
FMU_M1: D29.1(I/O) D29.10(NC) H27.1 R135.2
FMU_M2: D29.2(I/O) D29.9(NC) H27.2 R136.2
FMU_M3: D29.4(I/O) D29.7(NC) H27.3 R137.2
FMU_M4: D29.5(I/O) D29.6(NC) H27.4 R138.2
FMU_M5: D30.1(I/O) D30.10(NC) H27.5 R139.2
FMU_M6: D30.2(I/O) D30.9(NC) H27.6 R140.2
FMU_M7: D30.4(I/O) D30.7(NC) H27.7 R141.2
FMU_M8: D30.5(I/O) D30.6(NC) H27.8 R142.2
FMU_NSAFETY_SWITCH_LED_OUT: R129.1 ; also on sheet 3
FMU_SAFETY_SWITCH_IN: R128.1 ; also on sheet 3
FMU_VDD_3V3: C144.1(IN) C145.1 ; also on sheet 2 3
GPS1_3V3: C144.3(OUT) CN16.8 H26.8
GPS1_5V: C142.3(OUT) D18.2
GPS1_I2C_SCL: CN16.4 D22.4(I/O) D22.7(NC) H26.4 R126.2
GPS1_I2C_SDA: CN16.5 D22.5(I/O) D22.6(NC) H26.5 R127.2
GPS1_RX: CN16.3 D22.2(I/O) D22.9(NC) H26.3 R125.2
GPS1_TX: CN16.2 D22.1(I/O) D22.10(NC) H26.2 R124.2
GPS1_VCC: CN16.1 H26.1
GPS2_5V: C146.3(OUT) CN9.1 D20.2 H12.1
GPS2_I2C_SCL: CN9.4 D24.4(I/O) D24.7(NC) H12.4 R133.2
GPS2_I2C_SDA: CN9.5 D24.5(I/O) D24.6(NC) H12.5 R134.2
GPS2_RX: CN9.3 D24.2(I/O) D24.9(NC) H12.3 R132.2
GPS2_TX: CN9.2 D24.1(I/O) D24.10(NC) H12.2 R131.2
I2C1_SCL_BASE_GPS1_MAG_LED_PM1: R126.1 ; also on sheet 1 3
I2C1_SDA_BASE_GPS1_MAG_LED_PM1: R127.1 ; also on sheet 1 3
I2C2_SCL_BASE_GPS2_MAG_LED_PM2: R133.1 ; also on sheet 1 3 5
I2C2_SDA_BASE_GPS2_MAG_LED_PM2: R134.1 ; also on sheet 1 3 5
I2C3_SCL_BASE_MS5611_BARBED_EXTERNAL1: R145.1 ; also on sheet 3
I2C3_SDA_BASE_MS5611_BARBED_EXTERNAL1: R146.1 ; also on sheet 3
IO_CH1: R188.1 U53.10(PA0-WKUP)
IO_CH2: R189.1 U53.11(PA1)
IO_CH3: R190.1 U53.45(PB8)
IO_CH4: R191.1 U53.46(PB9)
IO_CH5: R192.1 U53.16(PA6)
IO_CH6: R193.1 U53.17(PA7)
IO_CH7: R194.1 U53.18(PB0)
IO_CH8: R195.1 U53.19(PB1)
IO_M1: D37.1(I/O) D37.10(NC) H32.1 R188.2
IO_M2: D37.2(I/O) D37.9(NC) H32.2 R189.2
IO_M3: D37.4(I/O) D37.7(NC) H32.3 R190.2
IO_M4: D37.5(I/O) D37.6(NC) H32.4 R191.2
IO_M5: D38.1(I/O) D38.10(NC) H32.5 R192.2
IO_M6: D38.2(I/O) D38.9(NC) H32.6 R193.2
IO_M7: D38.4(I/O) D38.7(NC) H32.7 R194.2
IO_M8: D38.5(I/O) D38.6(NC) H32.8 R195.2
IO_MCU_OSC_IN: C210.1 U53.5(PD0-OSC_IN) U54.1(OSC1)
IO_MCU_OSC_OUT: C211.1 U53.6(PD1-OSC_OUT) U54.3(OSC2)
IO_MCU_VDDA: C208.1 C209.1 L6.2 U53.9(VDDA)
IO_NRST: CN20.9 D36.4(I/O) H31.9 U53.7(NRST) ; also on sheet 2
IO_NSAFETY_SWITCH_LED_OUT: R197.1 U53.26(PB13)
IO_PPM_INPUT: U53.29(PA8)
IO_RSSI_IN: U53.15(PA5) U53.33(PA12)
IO_SAFETY_SWITCH_IN: R196.1 U53.41(PB5)
IO_SBUS_INPUT: U53.22(PB11)
IO_SBUS_OUTPUT: U53.21(PB10)
IO_SPARE_GPIO1: CN20.7 D36.1(I/O) D36.10(NC) H31.7 U53.42(PB6)
IO_SPARE_GPIO2: CN20.8 D36.2(I/O) D36.9(NC) H31.8 U53.43(PB7)
IO_SWCLK: CN20.5 D35.4(I/O) D35.7(NC) H31.5 U53.37(PA14)
IO_SWDIO: CN20.4 D35.2(I/O) D35.9(NC) H31.4 U53.34(PA13)
IO_SWO: CN20.6 D35.5(I/O) D35.6(NC) H31.6 U53.39(PB3)
IO_USART1_RX_DSM: R198.1 U53.31(PA10)
IO_USART1_TX_DEBUG: CN20.2 D35.1(I/O) D35.10(NC) H31.2 U53.30(PA9)
IO_VDD_3V3: C204.1 C205.1 C206.1 C207.1 CN20.1 H31.1 L6.1 R180.1 U53.24(VDD_1) U53.36(VDD_2) U53.48(VDD_3) ; also on sheet 2
IO_VDD_SERVO_SENS: R183.2 R184.2 U53.14(PA4)
NBUS_OUT_EN: U53.40(PB4)
NFC_GPIO: R147.1 ; also on sheet 3
NIO_LED_AMBER: R186.1 U53.28(PB15)
NIO_LED_BLUE: R185.1 U53.27(PB14)
SAFETY_LED: CN16.7 D23.2(I/O) D23.9(NC) H26.7 R129.2 R197.2
SAFETY_SWITCH_IN: CN16.6 D23.1(I/O) D23.10(NC) H26.6 R128.2 R196.2
TELEM1_5V: C137.3(OUT) CN2.1 D13.2 H6.1
TELEM1_CTS: CN2.4 D12.4(I/O) D12.7(NC) H6.4 R62.2
TELEM1_RTS: CN2.5 D12.5(I/O) D12.6(NC) H6.5 R63.2
TELEM1_RX: CN2.3 D12.2(I/O) D12.9(NC) H6.3 R61.2
TELEM1_TX: CN2.2 D12.1(I/O) D12.10(NC) H6.2 R120.2
TELEM2_5V: C138.3(OUT) CN17.1 D25.2 H24.1
TELEM2_CTS: CN17.4 D26.4(I/O) D26.7(NC) H24.4 R123.2
TELEM2_RTS: CN17.5 D26.5(I/O) D26.6(NC) H24.5 R96.2
TELEM2_RX: CN17.3 D26.2(I/O) D26.9(NC) H24.3 R122.2
TELEM2_TX: CN17.2 D26.1(I/O) D26.10(NC) H24.2 R121.2
TELEM3_5V: C140.3(OUT) CN18.1 D27.2 H25.1
TELEM3_CTS: CN18.4 D28.4(I/O) D28.7(NC) H25.4 R99.2
TELEM3_RTS: CN18.5 D28.5(I/O) D28.6(NC) H25.5 R100.2
TELEM3_RX: CN18.3 D28.2(I/O) D28.9(NC) H25.3 R98.2
TELEM3_TX: CN18.2 D28.1(I/O) D28.10(NC) H25.2 R97.2
UART4_RX: R144.1 ; also on sheet 3
UART4_TX: R143.1 ; also on sheet 3
UART5_CTS_TELEM2: R123.1 ; also on sheet 3
UART5_RTS_TELEM2: R96.1 ; also on sheet 3
UART5_RX_TELEM2: R122.1 ; also on sheet 3
UART5_TX_TELEM2: R121.1 ; also on sheet 3
UART7_CTS_TELEM1: R62.1 ; also on sheet 3
UART7_RTS_TELEM1: R63.1 ; also on sheet 3
UART7_RX_TELEM1: R61.1 ; also on sheet 3
UART7_TX_TELEM1: R120.1 ; also on sheet 3
UART8_RX_GPS2: R132.1 ; also on sheet 3
UART8_TX_GPS2: R131.1 ; also on sheet 3
UART_I2C_EXT2_5V: C148.3(OUT) CN19.1 D31.2 H30.1
UART_I2C_EXT2_I2C_SCL: CN19.4 D32.4(I/O) D32.7(NC) H30.4 R145.2
UART_I2C_EXT2_I2C_SDA: CN19.5 D32.5(I/O) D32.6(NC) H30.5 R146.2
UART_I2C_EXT2_NFC_GPIO: CN19.6 D33.2 H30.6 R147.2
UART_I2C_EXT2_UART_RX: CN19.3 D32.2(I/O) D32.9(NC) H30.3 R144.2
UART_I2C_EXT2_UART_TX: CN19.2 D32.1(I/O) D32.10(NC) H30.2 R143.2
USART1_RX_GPS1: R125.1 ; also on sheet 3
USART1_TX_GPS1: R124.1 ; also on sheet 3
USART2_CTS_TELEM3: R99.1 ; also on sheet 3
USART2_RTS_TELEM3: R100.1 ; also on sheet 3
USART2_RX_TELEM3: R98.1 ; also on sheet 3
USART2_TX_TELEM3: R97.1 ; also on sheet 3
USART6_RX_FROM_IO__RC_INPUT: R178.1 ; also on sheet 3
USART6_TX_TO_IO__NC: R179.1 ; also on sheet 3
Net-(C117-1): C117.1 CN15.1 RJ1.6
Net-(C117-2): C117.2 L4.2
Net-(C118-1): C118.1 CN15.2 RJ1.3
Net-(C118-2): C118.2 L4.3
Net-(C119-1): C119.1 CN15.3 RJ1.2
Net-(C119-2): C119.2 L5.2
Net-(C120-1): C120.1 CN15.4 RJ1.1
Net-(C120-2): C120.2 L5.3
Net-(C125-1): C125.1 C126.1 C127.1 C128.1 U40.16(PFBIN1) U40.19(PFBOUT) U40.30(PFBIN2)
Net-(C212-3): C212.3(OUT) CN21.1 D39.2
Net-(CN21-3): CN21.3 D40.2 R198.2
Net-(LED6-1): LED6.1(C) R113.1
Net-(LED7-1): LED7.1(C) R185.2
Net-(LED10-2): LED10.2(C) R186.2
Net-(LED11-1): LED11.1(C) R187.2
Net-(OSC1-3): OSC1.3(OUT) R115.1
Net-(R111-1): R111.1 U40.33(CRS/CRS_DV/LED_CFG)
Net-(R112-1): R112.1 U40.32(RX_DV/MII_MODE)
Net-(R113-2): R113.2 U40.21(LED_SPEED/AN1)
Net-(R114-2): R114.2 U40.20(RBIAS)
Net-(R178-2): R178.2 U53.12(PA2)
Net-(R179-2): R179.2 U53.13(PA3)
Net-(R180-2): R180.2 U53.38(PA15)
Net-(R181-2): R181.2 U53.20(PB2)
Net-(R182-1): R182.1 U53.44(BOOT0)

Not connected (* = marked no-connect by the designer): CN20 3*; D36 5(I/O)* 6(NC)* 7(NC)*; H31 3*; OSC1 4(VCC); RJ1 4* 5* 7* 8*; U40 2(TX_CLK)* 6(TXD_2)* 7(TXD_3)* 8(RESERVED)* 9(RESERVED)* 10(RESERVED)* 22(LED_LINK/AN0)* 27(X2)* 31(RX_CLK)* 34(RX_ER/MDIX_EN)* 35(COL/PHYAD0)* 38(RXD_2/PHYAD3)* 39(RXD_3/PHYAD4)*; U53 3(PC14-OSC32_IN)* 4(PC15-OSC32_OUT)* 25(PB12)* 32(PA11)*

## Notes on the sheets
sheet 8
- Full GPS plus Safety Switch Port
  GPS 1
  (UART1 & I2C1)
- TELEM1
- 2.54 x 6 Pin for debug
- N-MOS,2A/20V
- TELEM2
- 2.54 x 10 Pin for debug
- GPS 2
  (UART8 & I2C2)
- 2.54 x 6 Pin for debug
- 2.54 x 6 Pin for debug
- TELEM3
- UART&I2C External2
- 2.54 x 6 Pin for debug
sheet 9
- FMU GPIO 3x8 2.54mm pin
- IO GPIO 3x8 2.54mm pin
sheet 10
- VDD Servo sense
- IO Status LED
- 2.54 x 10 Pin for debug
sheet 11
- DSM-IN
- NEED TO CHANGE
  JST-ZH-SMT-VERTICAL
